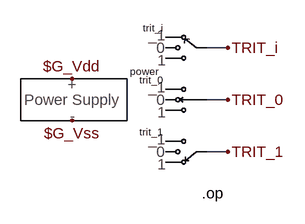
[diagram p0: schematic trit_test.asc]
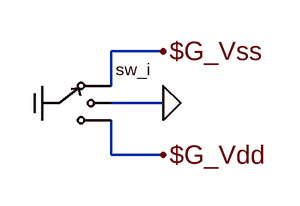
[diagram p1: sub-circuit trit-i.asc]
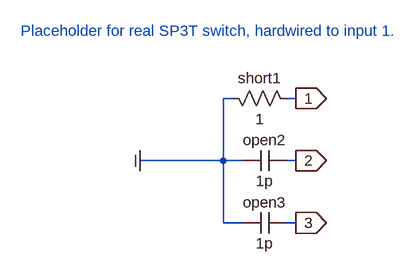
[diagram p2: sub-circuit sp3t-1.asc]
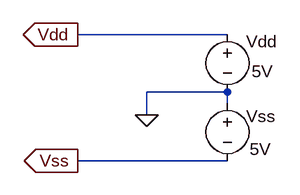
[diagram p3: sub-circuit tpower.asc]
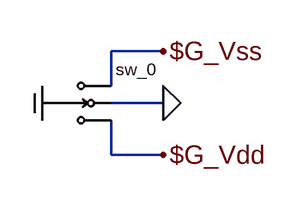
[diagram p4: sub-circuit trit-0.asc]
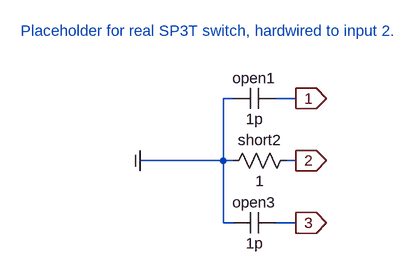
[diagram p5: sub-circuit sp3t-2.asc]
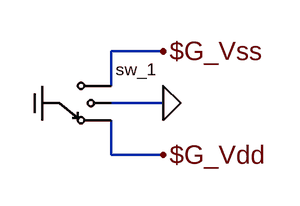
[diagram p6: sub-circuit trit-1.asc]
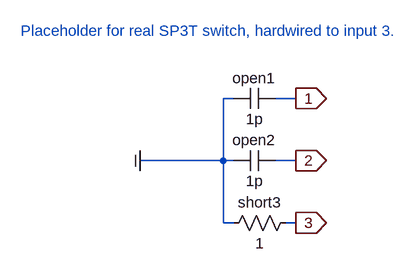
[diagram p7: sub-circuit sp3t-3.asc]
trit_test.asc, the LTspice schematic file:
Version 4
SHEET 1 880 680
WIRE 224 96 192 96
WIRE 224 176 192 176
WIRE 224 256 192 256
FLAG -16 144 $G_Vdd
FLAG -16 208 $G_Vss
FLAG 224 96 TRIT_i
FLAG 224 176 TRIT_0
FLAG 224 256 TRIT_1
SYMBOL trit-i 128 96 M0
SYMATTR InstName trit_i
SYMBOL tpower -16 176 R0
SYMATTR InstName power
SYMBOL trit-0 128 176 M0
SYMATTR InstName trit_0
SYMBOL trit-1 128 256 M0
SYMATTR InstName trit_1
TEXT 184 320 Left 0 !.op

trit-i.asc, the sub-circuit schematic file:
Version 4
SHEET 1 880 680
WIRE 224 96 176 96
WIRE 176 128 176 96
WIRE 224 144 176 144
WIRE 176 192 176 160
WIRE 224 192 176 192
FLAG 112 144 COM
IOPIN 112 144 In
FLAG 224 96 $G_Vss
FLAG 224 144 0
FLAG 224 192 $G_Vdd
SYMBOL sp3t-1 176 144 R0
SYMATTR InstName sw_i

sp3t-1.asc, the sub-circuit schematic file:
Version 4
SHEET 1 880 680
WIRE 144 64 128 64
WIRE 240 64 224 64
WIRE 128 160 128 64
WIRE 128 160 0 160
WIRE 160 160 128 160
WIRE 240 160 224 160
WIRE 128 256 128 160
WIRE 160 256 128 256
WIRE 240 256 224 256
FLAG 0 160 COM
IOPIN 0 160 In
FLAG 240 64 1
IOPIN 240 64 Out
FLAG 240 160 2
IOPIN 240 160 Out
FLAG 240 256 3
IOPIN 240 256 Out
SYMBOL res 128 48 M90
WINDOW 0 0 56 VBottom 0
WINDOW 3 32 56 VTop 0
SYMATTR InstName short1
SYMATTR Value 1
SYMBOL cap 224 144 R90
WINDOW 0 0 32 VBottom 0
WINDOW 3 32 32 VTop 0
SYMATTR InstName open2
SYMATTR Value 1p
SYMBOL cap 224 240 R90
WINDOW 0 0 32 VBottom 0
WINDOW 3 32 32 VTop 0
SYMATTR InstName open3
SYMATTR Value 1p
TEXT -184 -40 Left 0 ;Placeholder for real SP3T switch, hardwired to input 1.

tpower.asc, the sub-circuit schematic file:
Version 4
SHEET 1 880 680
WIRE -112 32 -320 32
WIRE -112 112 -224 112
WIRE -112 128 -112 112
WIRE -224 144 -224 112
WIRE -112 208 -320 208
FLAG -224 144 0
FLAG -320 32 Vdd
IOPIN -320 32 Out
FLAG -320 208 Vss
IOPIN -320 208 Out
SYMBOL voltage -112 16 R0
WINDOW 0 26 26 Left 0
WINDOW 3 34 68 Left 0
SYMATTR InstName Vdd
SYMATTR Value 5V
SYMBOL voltage -112 112 R0
WINDOW 0 26 34 Left 0
WINDOW 3 31 80 Left 0
SYMATTR InstName Vss
SYMATTR Value 5V

trit-0.asc, the sub-circuit schematic file:
Version 4
SHEET 1 880 680
WIRE 224 96 176 96
WIRE 176 128 176 96
WIRE 224 144 176 144
WIRE 176 192 176 160
WIRE 224 192 176 192
FLAG 112 144 COM
IOPIN 112 144 In
FLAG 224 96 $G_Vss
FLAG 224 144 0
FLAG 224 192 $G_Vdd
SYMBOL sp3t-2 176 144 R0
SYMATTR InstName sw_0

sp3t-2.asc, the sub-circuit schematic file:
Version 4
SHEET 1 880 680
WIRE 144 64 128 64
WIRE 240 64 208 64
WIRE 128 160 128 64
WIRE 128 160 0 160
WIRE 144 160 128 160
WIRE 240 160 224 160
WIRE 128 256 128 160
WIRE 144 256 128 256
WIRE 240 256 208 256
FLAG 0 160 COM
IOPIN 0 160 In
FLAG 240 64 1
IOPIN 240 64 Out
FLAG 240 160 2
IOPIN 240 160 Out
FLAG 240 256 3
IOPIN 240 256 Out
SYMBOL cap 208 48 R90
WINDOW 0 0 32 VBottom 0
WINDOW 3 32 32 VTop 0
SYMATTR InstName open1
SYMATTR Value 1p
SYMBOL cap 208 240 R90
WINDOW 0 0 32 VBottom 0
WINDOW 3 32 32 VTop 0
SYMATTR InstName open3
SYMATTR Value 1p
SYMBOL res 240 144 R90
WINDOW 0 0 56 VBottom 0
WINDOW 3 32 56 VTop 0
SYMATTR InstName short2
SYMATTR Value 1
TEXT -184 -40 Left 0 ;Placeholder for real SP3T switch, hardwired to input 2.

trit-1.asc, the sub-circuit schematic file:
Version 4
SHEET 1 880 680
WIRE 224 96 176 96
WIRE 176 128 176 96
WIRE 224 144 176 144
WIRE 176 192 176 160
WIRE 224 192 176 192
FLAG 112 144 COM
IOPIN 112 144 In
FLAG 224 96 $G_Vss
FLAG 224 144 0
FLAG 224 192 $G_Vdd
SYMBOL sp3t-3 176 144 R0
SYMATTR InstName sw_1

sp3t-3.asc, the sub-circuit schematic file:
Version 4
SHEET 1 880 680
WIRE 144 64 128 64
WIRE 240 64 208 64
WIRE 128 160 128 64
WIRE 128 160 0 160
WIRE 144 160 128 160
WIRE 240 160 208 160
WIRE 128 256 128 160
WIRE 144 256 128 256
WIRE 240 256 224 256
FLAG 0 160 COM
IOPIN 0 160 In
FLAG 240 64 1
IOPIN 240 64 Out
FLAG 240 160 2
IOPIN 240 160 Out
FLAG 240 256 3
IOPIN 240 256 Out
SYMBOL cap 144 48 M90
WINDOW 0 0 32 VBottom 0
WINDOW 3 32 32 VTop 0
SYMATTR InstName open1
SYMATTR Value 1p
SYMBOL cap 144 144 M90
WINDOW 0 0 32 VBottom 0
WINDOW 3 32 32 VTop 0
SYMATTR InstName open2
SYMATTR Value 1p
SYMBOL res 240 240 R90
WINDOW 0 0 56 VBottom 0
WINDOW 3 32 56 VTop 0
SYMATTR InstName short3
SYMATTR Value 1
TEXT -184 -40 Left 0 ;Placeholder for real SP3T switch, hardwired to input 3.

The netlist it stands for:
* trit_test.asc
Xtrit_i TRIT_i trit-i
Xpower $G_Vdd $G_Vss tpower
Xtrit_0 TRIT_0 trit-0
Xtrit_1 TRIT_1 trit-1

* block symbol definitions
.subckt trit-i COM
Xsw_i $G_Vss 0 COM $G_Vdd sp3t-1
.ends trit-i

.subckt sp3t-1 1 2 COM 3
R§short1 COM 1 1
C§open2 2 COM 1p
C§open3 3 COM 1p
* Placeholder for real SP3T switch, hardwired to input 1.
.ends sp3t-1

.subckt tpower Vdd Vss
Vdd Vdd 0 5V
Vss 0 Vss 5V
.ends tpower

.subckt trit-0 COM
Xsw_0 $G_Vss 0 COM $G_Vdd sp3t-2
.ends trit-0

.subckt sp3t-2 1 2 COM 3
C§open1 1 COM 1p
C§open3 3 COM 1p
R§short2 2 COM 1
* Placeholder for real SP3T switch, hardwired to input 2.
.ends sp3t-2

.subckt trit-1 COM
Xsw_1 $G_Vss 0 COM $G_Vdd sp3t-3
.ends trit-1

.subckt sp3t-3 1 2 COM 3
C§open1 COM 1 1p
C§open2 COM 2 1p
R§short3 3 COM 1
* Placeholder for real SP3T switch, hardwired to input 3.
.ends sp3t-3

.op
.backanno
.end